# Altium schematic sheet IO.SchDoc
size A4
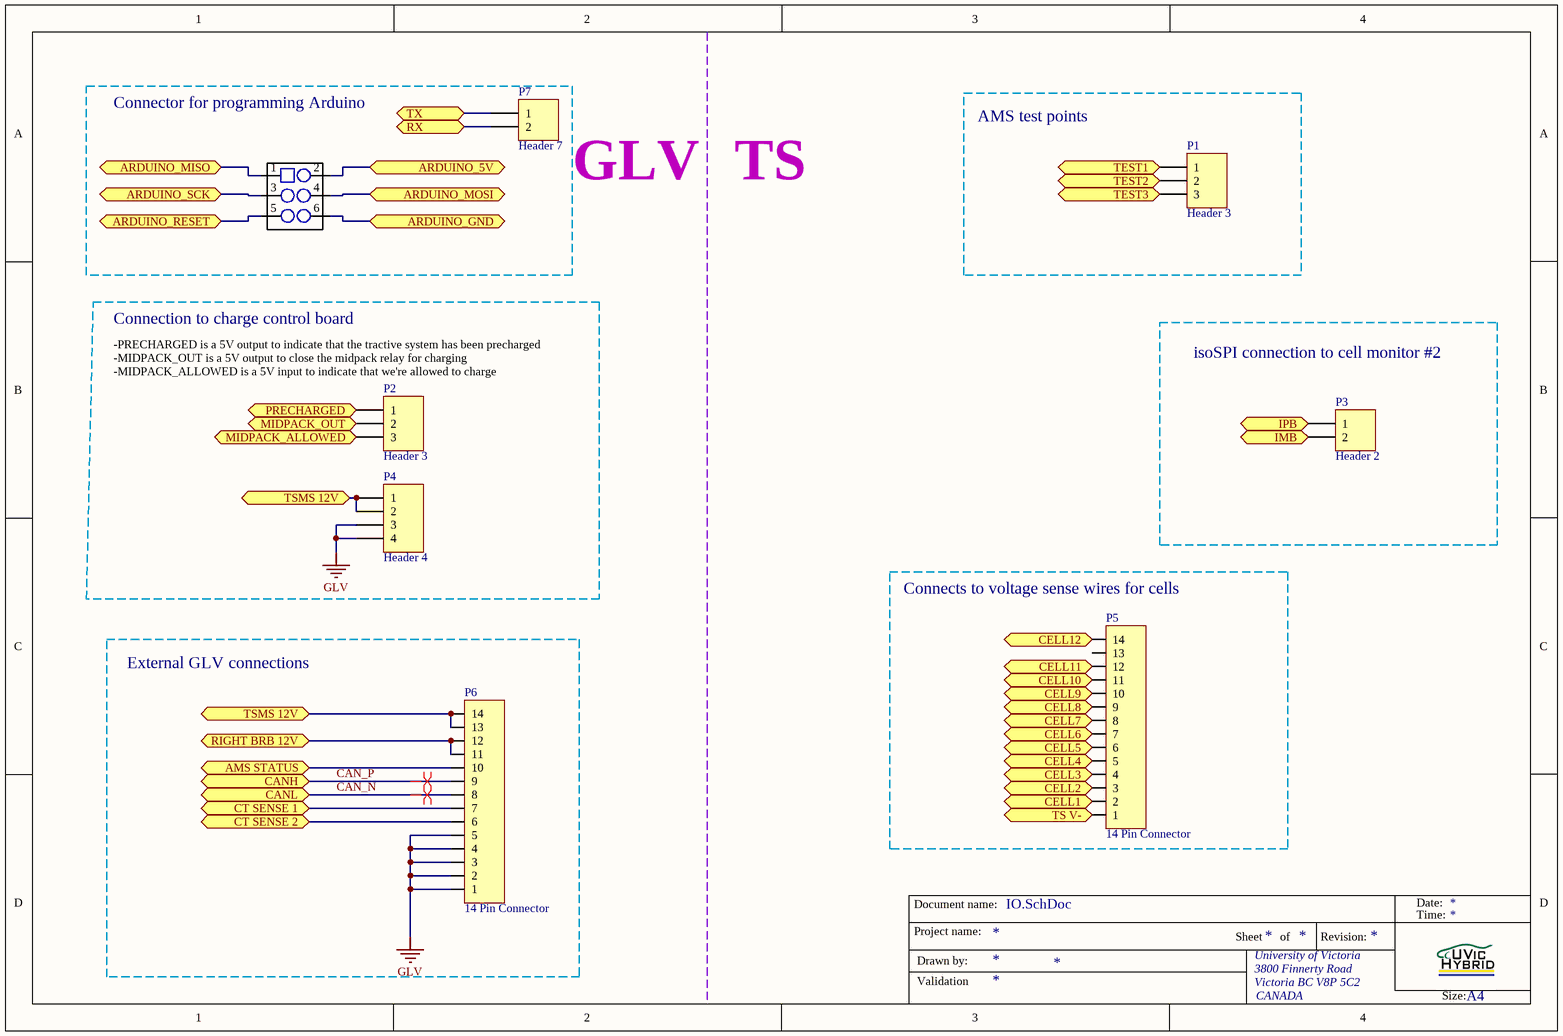
[diagram p0: IO.SchDoc]

## Parts
1  ICSP Connector  [ICSP Connector]  (value not drawn)
P1  Header 3  [3-pin Vertical nanofit]
P2  Header 3  [3-pin Vertical nanofit]
P3  Header 2  [2 Pin Nanofit]
P4  Header 4  [4 Pin Vertical Nanofit]
P5  14 Pin Connector  [TE Connectivity 14 Pin]
P6  14 Pin Connector  [TE Connectivity 14 Pin]
P7  Header 7  [2 Pin Nanofit]

## Blocks framed on the sheet
Connector for programming Arduino: 1 P7
AMS test points: P1
Connection to charge control board: P2 P4
isoSPI connection to cell monitor #2: P3
Connects to voltage sense wires for cells: P5
External GLV connections: P6

## Ports
AMS STATUS, ARDUINO_5V, ARDUINO_GND, ARDUINO_MISO, ARDUINO_MOSI, ARDUINO_RESET, ARDUINO_SCK, CANH, CANL, CELL1, CELL2, CELL3, CELL4, CELL5, CELL6, CELL7, CELL8, CELL9, CELL10, CELL11, CELL12, CT SENSE 1, CT SENSE 2, IMB, IPB, MIDPACK_ALLOWED, MIDPACK_OUT, PRECHARGED, RIGHT BRB 12V, RX, TEST1, TEST2, TEST3, TS V-, TSMS 12V, TX

## Nets
GLV: P4.3 P4.4 P6.1 P6.2 P6.3 P6.4 P6.5
AMS STATUS: P6.10 ; port AMS STATUS
ARDUINO_5V: 1.2 ; port ARDUINO_5V
ARDUINO_GND: 1.6 ; port ARDUINO_GND
ARDUINO_MISO: 1.1 ; port ARDUINO_MISO
ARDUINO_MOSI: 1.4 ; port ARDUINO_MOSI
ARDUINO_RESET: 1.5 ; port ARDUINO_RESET
ARDUINO_SCK: 1.3 ; port ARDUINO_SCK
CAN_N: P6.8 ; port CANL
CAN_P: P6.9 ; port CANH
CELL1: P5.2 ; port CELL1
CELL2: P5.3 ; port CELL2
CELL3: P5.4 ; port CELL3
CELL4: P5.5 ; port CELL4
CELL5: P5.6 ; port CELL5
CELL6: P5.7 ; port CELL6
CELL7: P5.8 ; port CELL7
CELL8: P5.9 ; port CELL8
CELL9: P5.10 ; port CELL9
CELL10: P5.11 ; port CELL10
CELL11: P5.12 ; port CELL11
CELL12: P5.14 ; port CELL12
CT SENSE 1: P6.7 ; port CT SENSE 1
CT SENSE 2: P6.6 ; port CT SENSE 2
IMB: P3.2 ; port IMB
IPB: P3.1 ; port IPB
MIDPACK_ALLOWED: P2.3 ; port MIDPACK_ALLOWED
MIDPACK_OUT: P2.2 ; port MIDPACK_OUT
PRECHARGED: P2.1 ; port PRECHARGED
RIGHT BRB 12V: P6.11 P6.12 ; port RIGHT BRB 12V
RX: P7.2 ; port RX
TEST1: P1.1 ; port TEST1
TEST2: P1.2 ; port TEST2
TEST3: P1.3 ; port TEST3
TS V-: P5.1 ; port TS V-
TSMS 12V: P4.1 P4.2 P6.13 P6.14 ; port TSMS 12V
TX: P7.1 ; port TX

Not connected (* = marked no-connect by the designer): P5 13

## Layout directives
differential pair: CAN_N, CAN_P

## Notes on the sheet
- GLV
- TS
- (near P2) -PRECHARGED is a 5V output to indicate that the tractive system has been precharged
  -MIDPACK_OUT is a 5V output to close the midpack relay for charging
  -MIDPACK_ALLOWED is a 5V input to indicate that we're allowed to charge
- Document name:
- Date:
- Time:
- Project name:
- Drawn by:
- Validation
- Sheet
- University of Victoria
- 3800 Finnerty Road
- Victoria BC V8P 5C2
- of
- Revision:
- CANADA
- Size:
- A4

## Library data of the parts
P1 P2 = Header 3: Header, 3-Pin; LatestRevisionDate: 17-Jul-2002; LatestRevisionNote: Re-released for DXP Platform.; Publisher: Altium Limited
P3 P7 = Header 2: Header, 2-Pin; LatestRevisionDate: 17-Jul-2002; LatestRevisionNote: Re-released for DXP Platform.; Publisher: Altium Limited
P4 = Header 4: Header, 4-Pin; LatestRevisionDate: 17-Jul-2002; LatestRevisionNote: Re-released for DXP Platform.; Publisher: Altium Limited
1 = ICSP Connector: Supplier Part Number: 952-2121-ND
P5 P6 = 14 Pin Connector: Supplier Part Number: A32482-ND